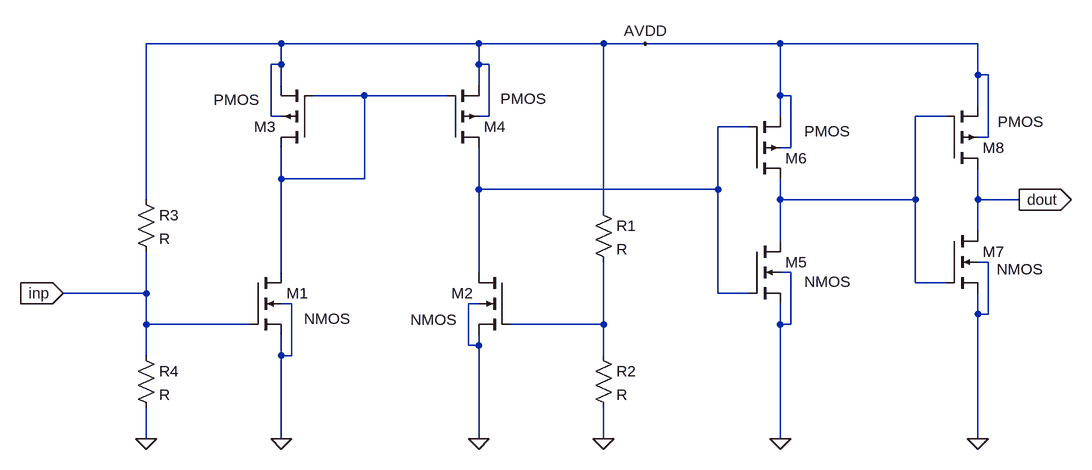
[diagram p0: schematic le_cmp.asc]
le_cmp.asc, the LTspice schematic file:
Version 4
SHEET 1 1464 708
WIRE 192 -176 -16 -176
WIRE 496 -176 192 -176
WIRE 688 -176 496 -176
WIRE 752 -176 688 -176
WIRE 960 -176 752 -176
WIRE 1264 -176 960 -176
WIRE 192 -144 192 -176
WIRE 192 -144 176 -144
WIRE 496 -144 496 -176
WIRE 512 -144 496 -144
WIRE 1264 -128 1264 -176
WIRE 1280 -128 1264 -128
WIRE 192 -112 192 -144
WIRE 496 -112 496 -144
WIRE 320 -96 240 -96
WIRE 448 -96 320 -96
WIRE 960 -96 960 -176
WIRE 976 -96 960 -96
WIRE 1264 -80 1264 -128
WIRE 176 -64 176 -144
WIRE 192 -64 176 -64
WIRE 512 -64 512 -144
WIRE 512 -64 496 -64
WIRE 960 -64 960 -96
WIRE 1216 -64 1168 -64
WIRE 912 -48 864 -48
WIRE 1280 -32 1280 -128
WIRE 1280 -32 1264 -32
WIRE 976 -16 976 -96
WIRE 976 -16 960 -16
WIRE 192 32 192 -16
WIRE 320 32 320 -96
WIRE 320 32 192 32
WIRE 496 48 496 -16
WIRE 864 48 864 -48
WIRE 864 48 496 48
WIRE -16 64 -16 -176
WIRE 960 64 960 32
WIRE 1168 64 1168 -64
WIRE 1168 64 960 64
WIRE 1264 64 1264 16
WIRE 1328 64 1264 64
WIRE 688 80 688 -176
WIRE 1264 112 1264 64
WIRE 960 128 960 64
WIRE 1280 160 1264 160
WIRE 192 176 192 32
WIRE 496 176 496 48
WIRE 976 176 960 176
WIRE 1168 192 1168 64
WIRE 1216 192 1168 192
WIRE -16 208 -16 144
WIRE -16 208 -144 208
WIRE 864 208 864 48
WIRE 912 208 864 208
WIRE 208 224 192 224
WIRE 496 224 480 224
WIRE 1264 240 1264 208
WIRE 1280 240 1280 160
WIRE 1280 240 1264 240
WIRE -16 256 -16 208
WIRE 144 256 -16 256
WIRE 688 256 688 160
WIRE 688 256 544 256
WIRE 960 256 960 224
WIRE 976 256 976 176
WIRE 976 256 960 256
WIRE 480 288 480 224
WIRE 496 288 496 272
WIRE 496 288 480 288
WIRE -16 304 -16 256
WIRE 192 304 192 272
WIRE 208 304 208 224
WIRE 208 304 192 304
WIRE 688 304 688 256
WIRE -16 432 -16 384
WIRE 192 432 192 304
WIRE 496 432 496 288
WIRE 688 432 688 384
WIRE 960 432 960 256
WIRE 1264 432 1264 240
FLAG 192 432 0
FLAG 496 432 0
FLAG -144 208 inp
IOPIN -144 208 In
FLAG 752 -176 AVDD
FLAG 960 432 0
FLAG 1264 432 0
FLAG 1328 64 dout
IOPIN 1328 64 Out
FLAG 688 432 0
FLAG -16 432 0
SYMBOL nmos4 144 176 R0
WINDOW 3 83 71 Left 2
SYMATTR InstName M1
SYMBOL pmos4 240 -16 R180
WINDOW 3 82 74 Left 2
SYMATTR InstName M3
SYMBOL nmos4 544 176 M0
WINDOW 3 81 73 Left 2
SYMATTR InstName M2
SYMBOL pmos4 448 -16 M180
WINDOW 3 81 75 Left 2
SYMATTR InstName M4
SYMBOL pmos4 912 32 M180
WINDOW 3 85 73 Left 2
SYMATTR InstName M6
SYMBOL nmos4 912 128 R0
WINDOW 3 85 62 Left 2
SYMATTR InstName M5
SYMBOL pmos4 1216 16 M180
WINDOW 3 79 72 Left 2
SYMATTR InstName M8
SYMBOL nmos4 1216 112 R0
WINDOW 3 77 59 Left 2
SYMATTR InstName M7
SYMBOL res 672 64 R0
SYMATTR InstName R1
SYMBOL res 672 288 R0
SYMATTR InstName R2
SYMBOL res -32 48 R0
SYMATTR InstName R3
SYMBOL res -32 288 R0
SYMATTR InstName R4

The netlist it stands for:
* le_cmp.asc
M1 N001 inp 0 0 NMOS
M3 N001 N001 AVDD AVDD PMOS
M2 N003 N004 0 0 NMOS
M4 N003 N001 AVDD AVDD PMOS
M6 N002 N003 AVDD AVDD PMOS
M5 N002 N003 0 0 NMOS
M8 dout N002 AVDD AVDD PMOS
M7 dout N002 0 0 NMOS
R1 AVDD N004 R
R2 N004 0 R
R3 AVDD inp R
R4 inp 0 R
.model NMOS NMOS
.model PMOS PMOS
.lib standard.mos
.backanno
.end